# Altium project PMT_simulator.PrjPCB (part 2 of 3)

## Sheet LVDS_IFC.SchDoc: =TopTitle
size 420 x 297 mm; EDA_Number: ARTIQ; Projet: Zotino; CheckedBy: -; Author: G.Kasprowicz; CompanyName: WUT ISE; DrawnBy: G.Kasprowicz; Organization: WUT ISE; Address1: PW ISE; Address2: Nowowiejska 15/19 00-665 Warsaw; Address3: gkasprow@gmail.com; Revision: 1.0.1; SheetNumber: -; SheetTotal: -; ModifiedBy: -; CheckedDate: -; Title2: LVDS_IFC; DivGrp: WUT ISE; Designer: G.Kasprowicz; ModifiedDate: -; ProjectName: Sensor Box
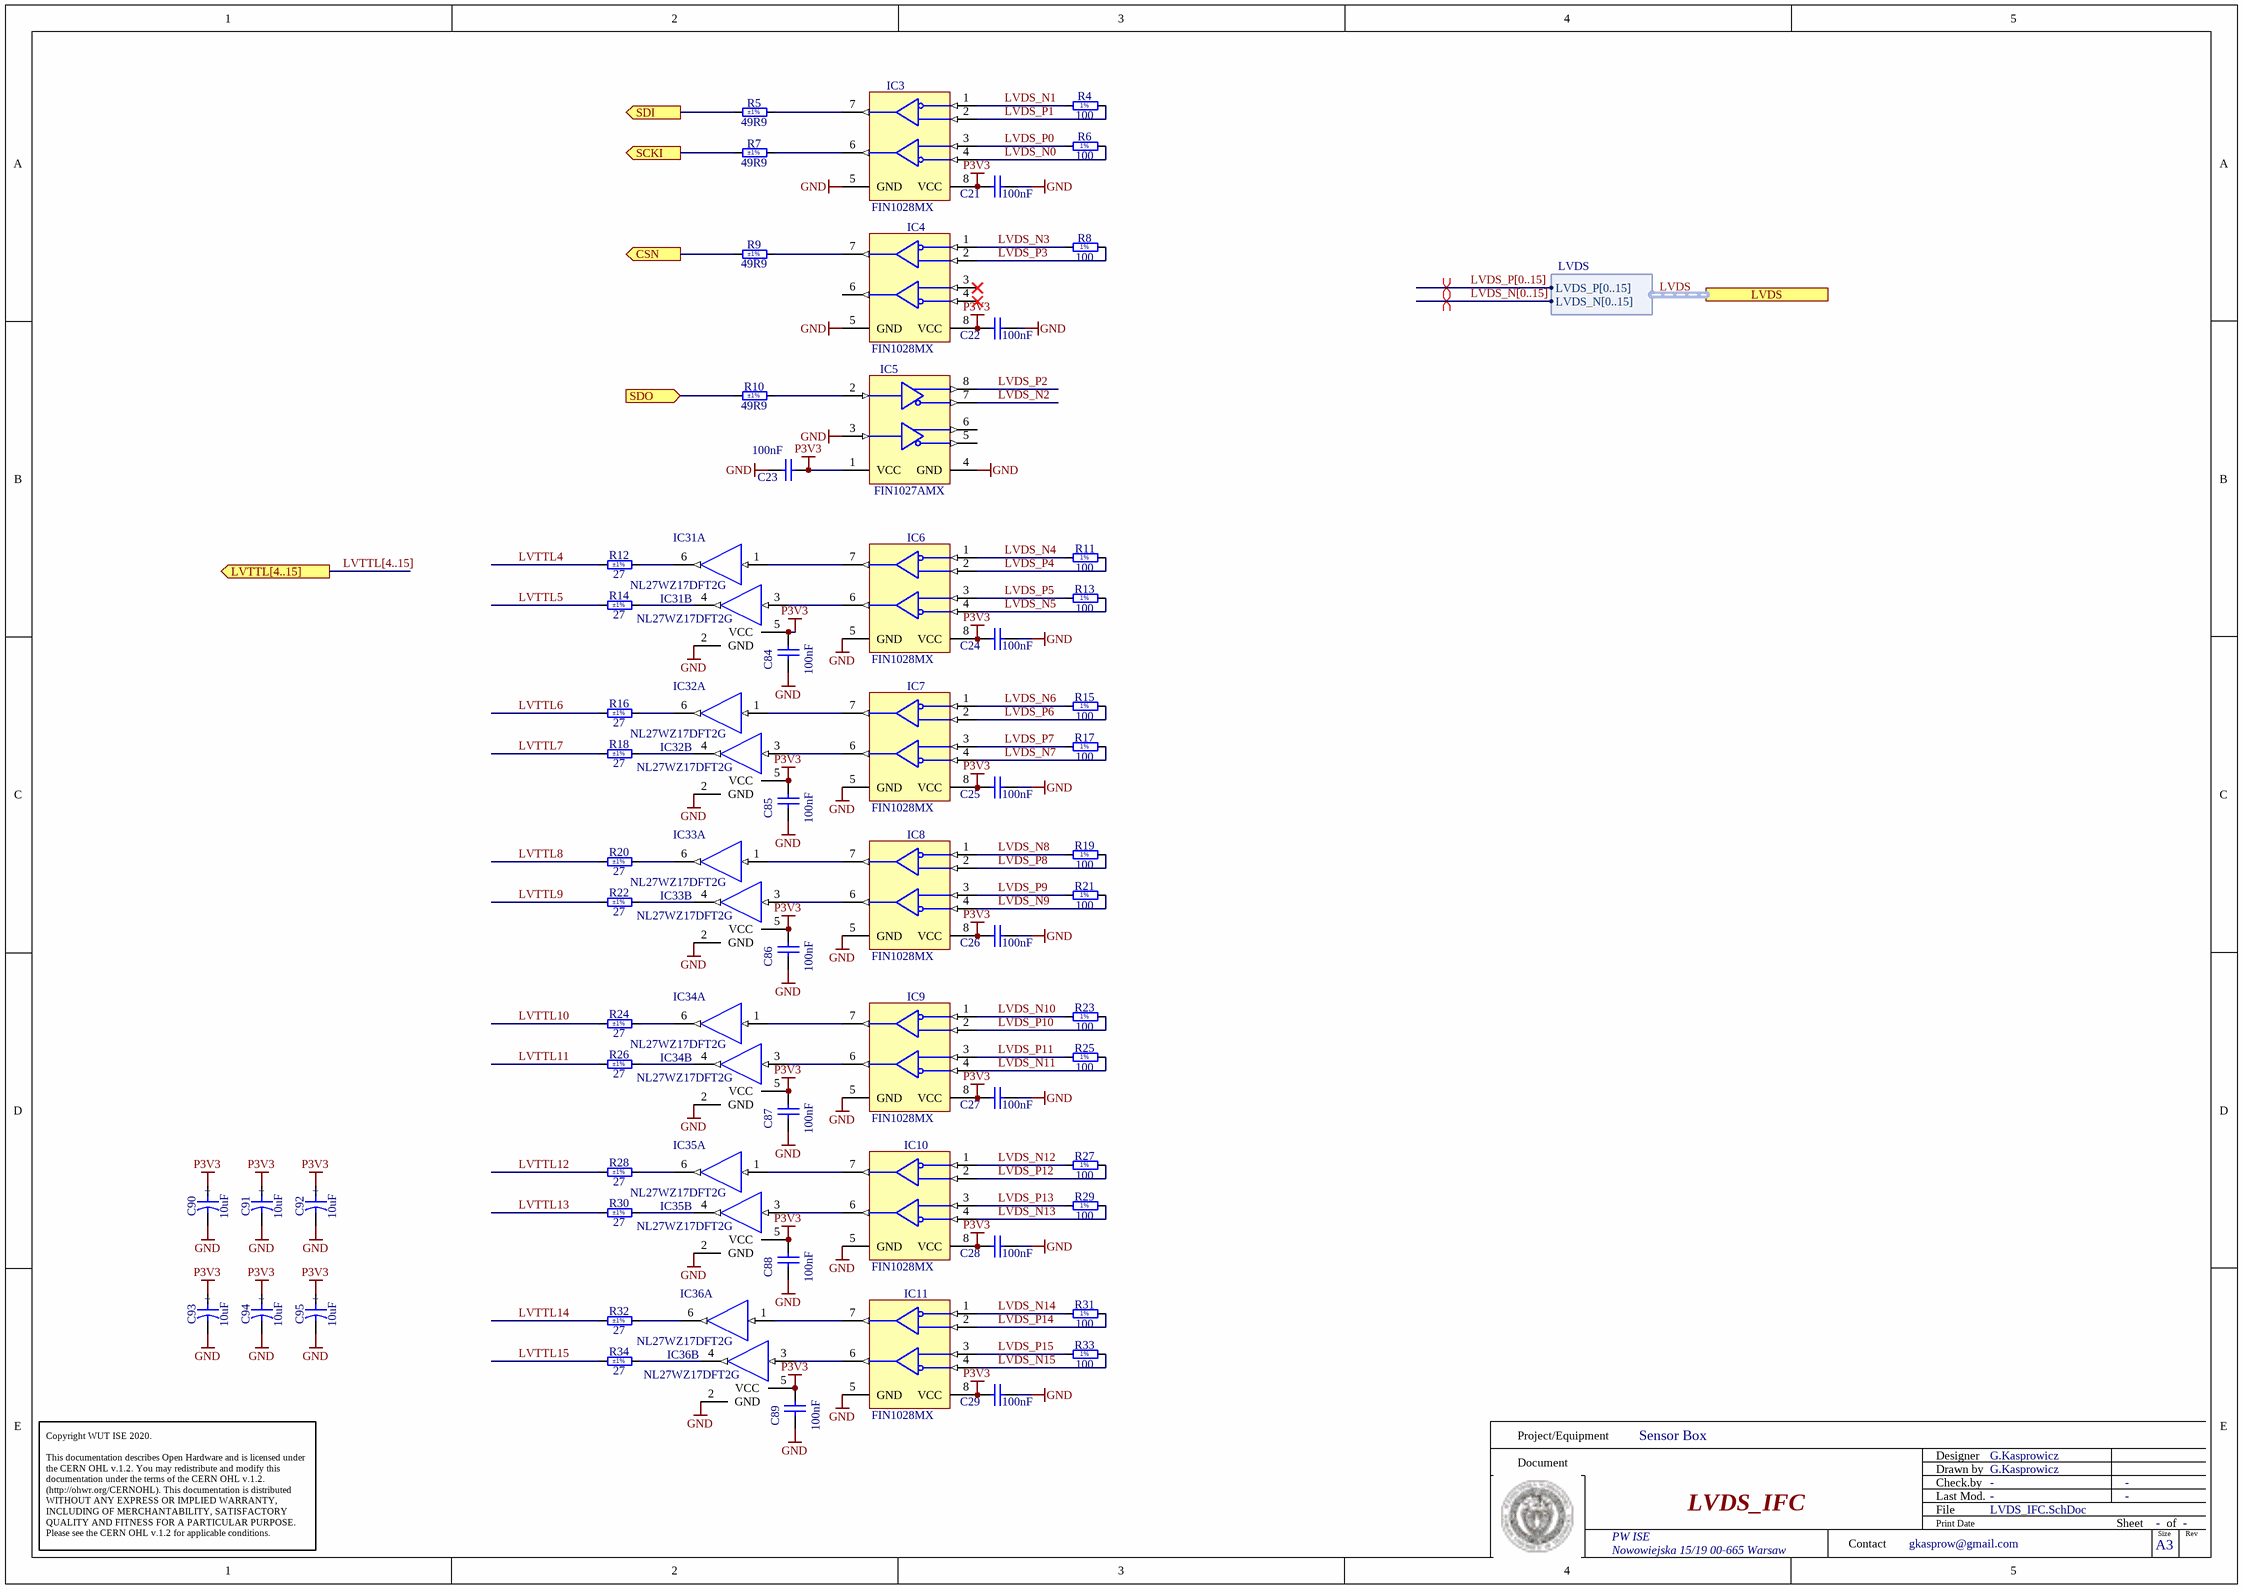
[diagram p3: LVDS_IFC.SchDoc]

### Parts
C21  100nF  [CAPC1005X55N]
C22  100nF  [CAPC1005X55N]
C23  100nF  [CAPC1005X55N]
C24  100nF  [CAPC1005X55N]
C25  100nF  [CAPC1005X55N]
C26  100nF  [CAPC1005X55N]
C27  100nF  [CAPC1005X55N]
C28  100nF  [CAPC1005X55N]
C29  100nF  [CAPC1005X55N]
C84  100nF  [CAPC1005X55N]
C85  100nF  [CAPC1005X55N]
C86  100nF  [CAPC1005X55N]
C87  100nF  [CAPC1005X55N]
C88  100nF  [CAPC1005X55N]
C89  100nF  [CAPC1005X55N]
C90  10uF  [CAPMP3216X180N]
C91  10uF  [CAPMP3216X180N]
C92  10uF  [CAPMP3216X180N]
C93  10uF  [CAPMP3216X180N]
C94  10uF  [CAPMP3216X180N]
C95  10uF  [CAPMP3216X180N]
IC3  FIN1028MX  [SOIC127P600X175-8N]
IC4  FIN1028MX  [SOIC127P600X175-8N]
IC5  FIN1027AMX  [SOIC127P600X175-8N]
IC6  FIN1028MX  [SOIC127P600X175-8N]
IC7  FIN1028MX  [SOIC127P600X175-8N]
IC8  FIN1028MX  [SOIC127P600X175-8N]
IC9  FIN1028MX  [SOIC127P600X175-8N]
IC10  FIN1028MX  [SOIC127P600X175-8N]
IC11  FIN1028MX  [SOIC127P600X175-8N]
IC31  NL27WZ17DFT2G  [SOT65P210X110-6N]  (parts A,B of 2)
IC32  NL27WZ17DFT2G  [SOT65P210X110-6N]  (parts A,B of 2)
IC33  NL27WZ17DFT2G  [SOT65P210X110-6N]  (parts A,B of 2)
IC34  NL27WZ17DFT2G  [SOT65P210X110-6N]  (parts A,B of 2)
IC35  NL27WZ17DFT2G  [SOT65P210X110-6N]  (parts A,B of 2)
IC36  NL27WZ17DFT2G  [SOT65P210X110-6N]  (parts A,B of 2)
R4  100  [RESC1005X40N]
R5  49R9  Tolerance: ±1%  [RESC1005X40N]
R6  100  [RESC1005X40N]
R7  49R9  Tolerance: ±1%  [RESC1005X40N]
R8  100  [RESC1005X40N]
R9  49R9  Tolerance: ±1%  [RESC1005X40N]
R10  49R9  Tolerance: ±1%  [RESC1005X40N]
R11  100  [RESC1005X40N]
R12  27  Tolerance: ±1%  [RESC1005X40N]
R13  100  [RESC1005X40N]
R14  27  Tolerance: ±1%  [RESC1005X40N]
R15  100  [RESC1005X40N]
R16  27  Tolerance: ±1%  [RESC1005X40N]
R17  100  [RESC1005X40N]
R18  27  Tolerance: ±1%  [RESC1005X40N]
R19  100  [RESC1005X40N]
R20  27  Tolerance: ±1%  [RESC1005X40N]
R21  100  [RESC1005X40N]
R22  27  Tolerance: ±1%  [RESC1005X40N]
R23  100  [RESC1005X40N]
R24  27  Tolerance: ±1%  [RESC1005X40N]
R25  100  [RESC1005X40N]
R26  27  Tolerance: ±1%  [RESC1005X40N]
R27  100  [RESC1005X40N]
R28  27  Tolerance: ±1%  [RESC1005X40N]
R29  100  [RESC1005X40N]
R30  27  Tolerance: ±1%  [RESC1005X40N]
R31  100  [RESC1005X40N]
R32  27  Tolerance: ±1%  [RESC1005X40N]
R33  100  [RESC1005X40N]
R34  27  Tolerance: ±1%  [RESC1005X40N]

### Ports
CSN (out), LVDS (harness LVDS), LVTTL[4..15] (out), SCKI (out), SDI (out), SDO (in)

### Harnesses
LVDS: LVDS_P[0..15], LVDS_N[0..15]

### Nets
GND: C21.1 C22.1 C23.1 C24.1 C25.1 C26.1 C27.1 C28.1 C29.1 C84.1 C85.1 C86.1 C87.1 C88.1 C89.1 C90.2 C91.2 C92.2 C93.2 C94.2 C95.2 IC3.5(GND) IC4.5(GND) IC5.3(DIN2RIN-) IC5.4(GND) IC6.5(GND) IC7.5(GND) IC8.5(GND) IC9.5(GND) IC10.5(GND) IC11.5(GND) IC31.2(GND) IC32.2(GND) IC33.2(GND) IC34.2(GND) IC35.2(GND) IC36.2(GND)
P3V3: C21.2 C22.2 C23.2 C24.2 C25.2 C26.2 C27.2 C28.2 C29.2 C84.2 C85.2 C86.2 C87.2 C88.2 C89.2 C90.1 C91.1 C92.1 C93.1 C94.1 C95.1 IC3.8(VCC) IC4.8(VCC) IC5.1(VCC) IC6.8(VCC) IC7.8(VCC) IC8.8(VCC) IC9.8(VCC) IC10.8(VCC) IC11.8(VCC) IC31.5(VCC) IC32.5(VCC) IC33.5(VCC) IC34.5(VCC) IC35.5(VCC) IC36.5(VCC)
VDD: IC31.5(VCC) IC32.5(VCC) IC33.5(VCC) IC34.5(VCC) IC35.5(VCC) IC36.5(VCC)
CSn: R9.1 ; port CSN
LVDS_N0: IC3.4(RIN2-) R6.2
LVDS_N1: IC3.1(RIN1-) R4.1
LVDS_N2: IC5.7(DOUT-)
LVDS_N3: IC4.1(RIN1-) R8.1
LVDS_N4: IC6.1(RIN1-) R11.1
LVDS_N5: IC6.4(RIN2-) R13.2
LVDS_N6: IC7.1(RIN1-) R15.1
LVDS_N7: IC7.4(RIN2-) R17.2
LVDS_N8: IC8.1(RIN1-) R19.1
LVDS_N9: IC8.4(RIN2-) R21.2
LVDS_N10: IC9.1(RIN1-) R23.1
LVDS_N11: IC9.4(RIN2-) R25.2
LVDS_N12: IC10.1(RIN1-) R27.1
LVDS_N13: IC10.4(RIN2-) R29.2
LVDS_N14: IC11.1(RIN1-) R31.1
LVDS_N15: IC11.4(RIN2-) R33.2
LVDS_P0: IC3.3(RIN2+) R6.1
LVDS_P1: IC3.2(RIN1+) R4.2
LVDS_P2: IC5.8(DOUT+)
LVDS_P3: IC4.2(RIN1+) R8.2
LVDS_P4: IC6.2(RIN1+) R11.2
LVDS_P5: IC6.3(RIN2+) R13.1
LVDS_P6: IC7.2(RIN1+) R15.2
LVDS_P7: IC7.3(RIN2+) R17.1
LVDS_P8: IC8.2(RIN1+) R19.2
LVDS_P9: IC8.3(RIN2+) R21.1
LVDS_P10: IC9.2(RIN1+) R23.2
LVDS_P11: IC9.3(RIN2+) R25.1
LVDS_P12: IC10.2(RIN1+) R27.2
LVDS_P13: IC10.3(RIN2+) R29.1
LVDS_P14: IC11.2(RIN1+) R31.2
LVDS_P15: IC11.3(RIN2+) R33.1
LVTTL4: R12.1
LVTTL5: R14.1
LVTTL6: R16.1
LVTTL7: R18.1
LVTTL8: R20.1
LVTTL9: R22.1
LVTTL10: R24.1
LVTTL11: R26.1
LVTTL12: R28.1
LVTTL13: R30.1
LVTTL14: R32.1
LVTTL15: R34.1
SCKI: R7.1 ; port SCKI
SDI: R5.1 ; port SDI
SDO: R10.1 ; port SDO
NetIC3_6: IC3.6(ROUT2) R7.2
NetIC3_7: IC3.7(ROUT1) R5.2
NetIC4_7: IC4.7(ROUT1) R9.2
NetIC5_2: IC5.2(DIN1) R10.2
NetIC6_6: IC6.6(ROUT2) IC31.3(IN)
NetIC6_7: IC6.7(ROUT1) IC31.1(IN)
NetIC7_6: IC7.6(ROUT2) IC32.3(IN)
NetIC7_7: IC7.7(ROUT1) IC32.1(IN)
NetIC8_6: IC8.6(ROUT2) IC33.3(IN)
NetIC8_7: IC8.7(ROUT1) IC33.1(IN)
NetIC9_6: IC9.6(ROUT2) IC34.3(IN)
NetIC9_7: IC9.7(ROUT1) IC34.1(IN)
NetIC10_6: IC10.6(ROUT2) IC35.3(IN)
NetIC10_7: IC10.7(ROUT1) IC35.1(IN)
NetIC11_6: IC11.6(ROUT2) IC36.3(IN)
NetIC11_7: IC11.7(ROUT1) IC36.1(IN)
NetIC31_4: IC31.4(OUT) R14.2
NetIC31_6: IC31.6(OUT) R12.2
NetIC32_4: IC32.4(OUT) R18.2
NetIC32_6: IC32.6(OUT) R16.2
NetIC33_4: IC33.4(OUT) R22.2
NetIC33_6: IC33.6(OUT) R20.2
NetIC34_4: IC34.4(OUT) R26.2
NetIC34_6: IC34.6(OUT) R24.2
NetIC35_4: IC35.4(OUT) R30.2
NetIC35_6: IC35.6(OUT) R28.2
NetIC36_4: IC36.4(OUT) R34.2
NetIC36_6: IC36.6(OUT) R32.2

Not connected (* = marked no-connect by the designer): IC4 3(RIN2+)* 4(RIN2-)* 6(ROUT2); IC5 5(DOUT-) 6(DOUT+)

### Buses and harness runs
bus LVDS_N[0..15]
bus LVDS_P[0..15]
bus LVTTL[4..15] = port LVTTL[4..15]
harness LVDS = port LVDS

### Layout directives
differential pair: (no net found under the mark)

### Notes on the sheet
- Project/Equipment
- Document
- Designer
- Drawn by
- Check.by
- Copyright WUT ISE 2020.
  This documentation describes Open Hardware and is licensed under the CERN OHL v.1.2. You may redistribute and modify this documentation under the terms of the CERN OHL v.1.2. (http://ohwr.org/CERNOHL). This documentation is distributed WITHOUT ANY EXPRESS OR IMPLIED WARRANTY, INCLUDING OF MERCHANTABILITY, SATISFACTORY QUALITY AND FITNESS FOR A PARTICULAR PURPOSE. Please see the CERN OHL v.1.2 for applicable conditions.
- Contact
- File
- Last Mod.
- Print Date
- Sheet
- Size
- A3
- of
- Rev
- (in symbol CTE3216-18_10UF_16V_20%_AVX_TCJ) +
- (in symbol R0402_100R_1%_0.0625W_100PPM) 1%

### Library data of the parts
C21-C29 C84-C89 = CC0402_100NF_16V_10%_X5R: Non-polarised capacitor; Part Description: SMD Multilayer Chip Ceramic Capacitor; Manufacturer: GENERIC; Manufacturer1 Part Number: GRM155R61C104KA88D; Voltage: 16V; TC: X5R; Tolerance: ±10%; Part Number: CC0402_100NF_16V_10%_X5R; Component Kind: Standard; Component Type: Standard; Pin Count: 2; Value: 100nF; Status: None; Manufacturer Part Number: CC0402_100NF_16V_10%_X5R; Case: 0402; Mounted: Yes; Socket: No; SMD: Yes; Sense: No; Manufacturer1 Example: MURATA; Manufacturer1 ComponentHeight: 0.55mm; HelpURL: \\cern.ch\dfs\Applications\Altium\Datasheets\CC0402_X5R_MURATA_GRM.pdf; Author: CERN DEM JLC; CreateDate: 10.12.2013; LatestRevisionDate: 10.12.2013
C90-C95 = CTE3216-18_10UF_16V_20%_AVX_TCJ: Polarised capacitor; Part Description: ESR 0R200 Tantalum Solid Electrolytic Chip Capacitor with Conductive Polymer Electrode; Manufacturer: AVX; Manufacturer Part Number: TCJA106M016R0200; Voltage: 16V; Tolerance: ±20%; Part Number: CTE3216-18_10UF_16V_20%_AVX_TCJ; Component Kind: Standard; Component Type: Standard; Pin Count: 2; Value: 10uF; Status: Preferred; Case: A; Mounted: Yes; Socket: No; SMD: Yes; Sense: No; ComponentHeight: 1.8mm; HelpURL: \\cern.ch\dfs\Applications\Altium\Datasheets\CTE_AVX_TCJ.pdf; Author: CERN DEM JLC; CreateDate: 29.03.2012; LatestRevisionDate: 29.03.2012
IC3 IC4 IC6-IC11 = IFC_FIN1028: 3.3V LVDS 2-Bit High-Speed Differential Reciever; Manufacturer: ON Semiconductor; PressFit: No; Bonding: No; Part Number: FIN1028MX; Component Kind: Standard; Component Type: Standard; Device: FIN1028MX; PackageDescription: SOIC 8, Pitch 1.27mm - Body 4x5mm, IPC Medium Density; Part Description: 3.3V LVDS 2-Bit High-Speed Differential Reciever; Manufacturer Part Number: FIN1028MX; Pin Count: 8; Case: SOIC8; Mounted: Yes; Socket: No; SMD: Yes; Sense: No; ComponentHeight: 0.8mm; Author: GK; HelpURL: \\cern.ch\dfs\Applications\Altium\Datasheets\FIN1101K8X.pdf; CreateDate: 08/11/2016; LatestRevisionDate: 08/11/2016
IC5 = IFC_FIN1027A: 3.3V LVDS, 2-Bit, High-Speed, Differential Driver; Manufacturer: ON Semiconductor; PressFit: No; Bonding: No; Part Number: FIN1027AMX; Component Kind: Standard; Component Type: Standard; Device: FIN1027AMX; PackageDescription: SOIC 8, Pitch 1.27mm - Body 4x5mm, IPC Medium Density; Part Description: 3.3V LVDS, 2-Bit, High-Speed, Differential Driver; Manufacturer Part Number: FIN1027AMX; Pin Count: 8; Case: SOIC8; Mounted: Yes; Socket: No; SMD: Yes; Sense: No; ComponentHeight: 0.8mm; Author: GK; HelpURL: \\cern.ch\dfs\Applications\Altium\Datasheets\FIN1101K8X.pdf; CreateDate: 08/11/2016; LatestRevisionDate: 08/11/2016
IC31-IC36 = NL27WZ17DFT2G: Dual Schmitt Trigger Buffer, Non-Inverting; Manufacturer: ON SEMICONDUCTOR; PressFit: No; Bonding: No; Part Number: NL27WZ17DFT2G; Component Kind: Standard; Component Type: Standard; Device: NL27WZ17DFT2G; PackageDescription: SOT363, SC-88, 0.65mm Pitch; 6 Pin, 1.25mm W X 2.00mm L X 1.10mm H body, IPC Medium Density; Part Description: Dual Schmitt Trigger Buffer, Non-Inverting; Manufacturer Part Number: NL27WZ17DF; Pin Count: 6; Case: SOT363; Mounted: Yes; Socket: No; SMD: Yes; Sense: No; ComponentHeight: 1.1mm; Author: CERN DEM BC; HelpURL: \\cern.ch\dfs\Applications\Altium\Datasheets\NL27WZ17DFT2G.pdf; CreateDate: 02.06.2020; LatestRevisionDate: 25.05.2022
R4 R6 R8 R11 R13 R15 R17 R19 R21 R23 R25 R27 R29 R31 R33 = R0402_100R_1%_0.0625W_100PPM: Resistor - 1%; Part Description: General Purpose Thick Film Chip Resistor; Manufacturer: GENERIC; Manufacturer1 Part Number: 232270671001L; TC: ±100ppm/°C; PressFit: No; Part Number: R0402_100R_1%_0.0625W_100PPM; Component Kind: Standard; Component Type: Standard; Pin Count: 2; Value: 100; Status: Not Recommended; Power: 0.0625W; Tolerance: ±1%; Manufacturer Part Number: R0402_100R_1%_0.0625W_100PPM; Case: 0402; Mounted: Yes; Sense: No; Socket: No; SMD: Yes; Manufacturer1 Example: YAGEO PHYCOMP; Manufacturer1 ComponentHeight: 0.4mm; HelpURL: \\cern.ch\dfs\Applications\Altium\Datasheets\R0402_Phycomp_RC0402.pdf; Author: CERN DEM JLC; CreateDate: 03.12.2007; LatestRevisionDate: 17.10.2012
R5 R7 R9 R10 = R0402_49R9_1%_0.0625W_100PPM: Resistor - 1%; Part Description: General Purpose Thick Film Chip Resistor; Manufacturer: GENERIC; Manufacturer1 Part Number: 232270674999L or RC0402FR-0749R9L; TC: ±100ppm/°C; PressFit: No; Part Number: R0402_49R9_1%_0.0625W_100PPM; Component Kind: Standard; Component Type: Standard; Pin Count: 2; Value: 49R9; Status: Not Recommended; Power: 0.0625W; Manufacturer Part Number: R0402_49R9_1%_0.0625W_100PPM; Case: 0402; Mounted: Yes; Sense: No; Socket: No; SMD: Yes; Manufacturer1 Example: YAGEO PHYCOMP; Manufacturer1 ComponentHeight: 0.4mm; HelpURL: \\cern.ch\dfs\Applications\Altium\Datasheets\R0402_Phycomp_RC0402.pdf; Author: CERN DEM JLC; CreateDate: 24.10.2012; LatestRevisionDate: 24.10.2012
R12 R14 R16 R18 R20 R22 R24 R26 R28 R30 R32 R34 = R0402_27R_1%_0.0625W_100PPM: Resistor - 1%; Part Description: General Purpose Thick Film Chip Resistor; Manufacturer: GENERIC; Manufacturer1 Part Number: 232270672709L; TC: ±100ppm/°C; PressFit: No; Part Number: R0402_27R_1%_0.0625W_100PPM; Component Kind: Standard; Component Type: Standard; Pin Count: 2; Value: 27; Status: Not Recommended; Power: 0.0625W; Manufacturer Part Number: R0402_27R_1%_0.0625W_100PPM; Case: 0402; Mounted: Yes; Sense: No; Socket: No; SMD: Yes; Manufacturer1 Example: YAGEO PHYCOMP; Manufacturer1 ComponentHeight: 0.4mm; HelpURL: \\cern.ch\dfs\Applications\Altium\Datasheets\R0402_Phycomp_RC0402.pdf; Author: CERN DEM JLC; CreateDate: 03.12.2007; LatestRevisionDate: 17.10.2012

## Sheet PULSE_TRIGGER.SchDoc: =TopTitle
size 420 x 297 mm; EDA_Number: ARTIQ; Projet: ALICE; CheckedBy: -; Author: G.Kasprowicz; CompanyName: WUT ISE; DrawnBy: G.Kasprowicz; Organization: WUT ISE; Address1: PW ISE; Address2: Nowowiejska 15/19 00-665 Warsaw; Address3: gkasprow@gmail.com; Revision: 1.0.1; SheetNumber: -; SheetTotal: -; ModifiedBy: -; CheckedDate: -; Title2: Pulse Trigger; DivGrp: WUT ISE; Designer: G.Kasprowicz; ModifiedDate: -; ProjectName: Sensor Box
Used 6 times, as channels U_PULSE_TRIGGER, U_PULSE_TRIGGER, U_PULSE_TRIGGER, U_PULSE_TRIGGER, U_PULSE_TRIGGER, U_PULSE_TRIGGER. Parts and nets are listed once, with the designators drawn on the sheet.
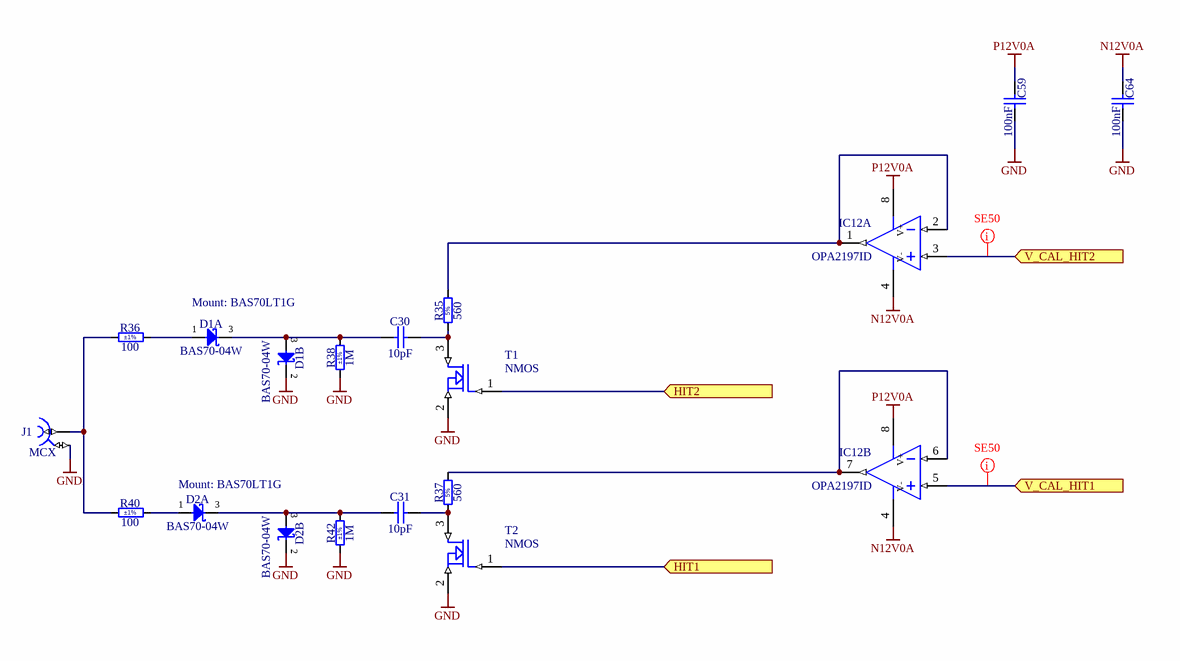
[diagram p4: PULSE_TRIGGER.SchDoc]

### Parts
C30  10pF  [CAPC1608X87N]
C31  10pF  [CAPC1608X87N]
C59  100nF  [CAPC1005X55N]
C64  100nF  [CAPC1005X55N]
D1  BAS70-04W  [SOT65P210X110-3N]  (parts A,B of 2)
D2  BAS70-04W  [SOT65P210X110-3N]  (parts A,B of 2)
IC12  OPA2197ID  [SOIC127P600X175-8N]  (parts A,B of 2)
J1  MCX  [AMPHENOL_919-383J-51A]
R35  560  [RESC2012X70N]
R36  100  Tolerance: ±1%  [RESC1608X55N]
R37  560  [RESC2012X70N]
R38  1M  Tolerance: ±1%  [RESC1608X55N]
R40  100  Tolerance: ±1%  [RESC1608X55N]
R42  1M  Tolerance: ±1%  [RESC1608X55N]
T1  NMOS  [CSD15380F3]
T2  NMOS  [CSD15380F3]

### Ports
HIT1 (in), HIT2 (in), V_CAL_HIT1 (in), V_CAL_HIT2 (in)

### Nets
GND: C59.1 C64.1 D1.2(C) D2.2(C) J1.2 R38.1 R42.1 T1.2(S) T2.2(S)
N12V0A: C64.2 IC12.4(V-)
P12V0A: C59.2 IC12.8(V+)
HIT1: T2.1(G) ; port HIT1
HIT2: T1.1(G) ; port HIT2
V_CAL_HIT1: IC12.5(IN+) ; port V_CAL_HIT1
V_CAL_HIT2: IC12.3(IN+) ; port V_CAL_HIT2
NetC30_1: C30.1 D1.3(COMAC) R38.2
NetC30_2: C30.2 R35.1 T1.3(D)
NetC31_1: C31.1 D2.3(COMAC) R42.2
NetC31_2: C31.2 R37.1 T2.3(D)
NetD1_1: D1.1(A) R36.2
NetD2_1: D2.1(A) R40.2
NetIC12_1: IC12.1(OUT) IC12.2(IN-) R35.2
NetIC12_6: IC12.6(IN-) IC12.7(OUT) R37.2
NetJ1_1: J1.1 R36.1 R40.1

### Channels
U_PULSE_TRIGGER: designators end in A; ports HIT1=LVTTL4 HIT2=LVTTL5 V_CAL_HIT1=VOUT1 V_CAL_HIT2=VOUT2
U_PULSE_TRIGGER: designators end in B; ports HIT1=LVTTL6 HIT2=LVTTL7 V_CAL_HIT1=VOUT3 V_CAL_HIT2=VOUT4
U_PULSE_TRIGGER: designators end in C; ports HIT1=LVTTL8 HIT2=LVTTL9 V_CAL_HIT1=VOUT5 V_CAL_HIT2=VOUT6
U_PULSE_TRIGGER: designators end in D; ports HIT1=LVTTL10 HIT2=LVTTL11 V_CAL_HIT1=VOUT7 V_CAL_HIT2=VOUT8
U_PULSE_TRIGGER: designators end in E; ports HIT1=LVTTL12 HIT2=LVTTL13 V_CAL_HIT1=VOUT9 V_CAL_HIT2=VOUT10
U_PULSE_TRIGGER: designators end in F; ports HIT1=LVTTL14 HIT2=LVTTL15 V_CAL_HIT1=VOUT11 V_CAL_HIT2=VOUT12

### Layout directives
net class SE50: VOUT1, VOUT2

### Notes on the sheet
- (near D1) Mount: BAS70LT1G
- (near D2) Mount: BAS70LT1G
- Project/Equipment
- Document
- Designer
- Drawn by
- Check.by
- Copyright WUT ISE 2020.
  This documentation describes Open Hardware and is licensed under the CERN OHL v.1.2. You may redistribute and modify this documentation under the terms of the CERN OHL v.1.2. (http://ohwr.org/CERNOHL). This documentation is distributed WITHOUT ANY EXPRESS OR IMPLIED WARRANTY, INCLUDING OF MERCHANTABILITY, SATISFACTORY QUALITY AND FITNESS FOR A PARTICULAR PURPOSE. Please see the CERN OHL v.1.2 for applicable conditions.
- Contact
- File
- Last Mod.
- Print Date
- Sheet
- Size
- A3
- of
- Rev
- (in symbol R0805_560R_5%_0.25W_200PPM_PANASONIC_ERJT) 5%

### Library data of the parts
C30 C31 = CC0603_10PF_50V_5%_NP0: Non-polarised capacitor; Part Description: SMD Multilayer Chip Ceramic Capacitor; Manufacturer: GENERIC; Manufacturer1 Part Number: 223886715109; Voltage: 50V; TC: C0G/NP0; Tolerance: ±5%; Part Number: CC0603_10PF_50V_5%_NP0; Component Kind: Standard; Component Type: Standard; Pin Count: 2; Value: 10pF; Status: Preferred; Manufacturer Part Number: CC0603_10PF_50V_5%_NP0; Case: 0603; Mounted: Yes; Socket: No; SMD: Yes; Sense: No; Manufacturer1 Example: PHYCOMP; Manufacturer1 ComponentHeight: 0.87mm; HelpURL: \\cern.ch\dfs\Applications\Altium\Datasheets\CC0603_NP0_PHYCOMP.pdf; Author: CERN DEM JLC; CreateDate: 03.12.2007; LatestRevisionDate: 03.12.2007
C59 C64 = CC0402_100NF_16V_10%_X7R: Non-polarised capacitor; Part Description: SMD Multilayer Chip Ceramic Capacitor; Manufacturer: GENERIC; Manufacturer1 Part Number: GRM155R71C104KA88D; Voltage: 16V; TC: X7R; Tolerance: ±10%; Part Number: CC0402_100NF_16V_10%_X7R; Component Kind: Standard; Component Type: Standard; Pin Count: 2; Value: 100nF; Status: Not Recommended; Manufacturer Part Number: CC0402_100NF_16V_10%_X7R; Case: 0402; Mounted: Yes; Socket: No; SMD: Yes; Sense: No; Manufacturer1 Example: MURATA; Manufacturer1 ComponentHeight: 0.55mm; HelpURL: \\cern.ch\dfs\Applications\Altium\Datasheets\CC0402_X7R_MURATA_GRM.pdf; Author: CERN DEM JLC; CreateDate: 05.12.2013; LatestRevisionDate: 03.12.2007
D1 D2 = BAS70-04W: Serial Schottky Diode; Part Description: Dual Series General-Purpose Schottky Diodes; Manufacturer: NXP SEMICONDUCTORS; Voltage: 70V; Power: 70mA; PressFit: No; Bonding: No; Part Number: BAS70-04W; Component Kind: Standard; Component Type: Standard; Device: BAS70-04W; PackageDescription: SOT323, 0.65mm Pitch; 3 Pin, 1.25mm W X 2.00mm L X 1.10mm H body, IPC Medium Density; Manufacturer Part Number: BAS70-04W; Pin Count: 3; Case: SOT323; Mounted: Yes; Socket: No; SMD: Yes; Sense: No; ComponentHeight: 1.10mm; HelpURL: \\cern.ch\dfs\Applications\Altium\Datasheets\BAS70-04W.pdf; Author: CERN DEM JLC; CreateDate: 05.12.2013; LatestRevisionDate: 05.12.2013
IC12 = OPA2197ID: Dual Operational Amplifier; Part Description: Dual, 36-V, Precision, Rail-to-Rail Input/Output, Low Offset Voltage, Operational Amplifiers; Manufacturer: TEXAS INSTRUMENTS; PressFit: No; Bonding: No; Part Number: OPA2197ID; Component Kind: Standard; Component Type: Standard; Device: OPA2197ID; PackageDescription: SOIC 8, Pitch 1.27mm - Body 4x5mm, IPC Medium Density; Manufacturer Part Number: OPA2197ID; Pin Count: 8; Case: SOIC8; Mounted: Yes; Socket: No; SMD: Yes; Sense: No; ComponentHeight: 1.75mm; Author: CERN DEM MR; HelpURL: \\cern.ch\dfs\Applications\Altium\Datasheets\OPA2197ID.pdf; CreateDate: 07.08.2019; LatestRevisionDate: 07.08.2019
J1 = AMPHENOL_919-383J-51A: Part Description: 50 Ohms, RF Connector, MCX Right Angle PCB Receptacle Jack; PressFit: No; Part Number: AMPHENOL_919-383J-51A; Component Kind: Standard; Component Type: Standard; Pin Count: 5; Family: MCX; Mounted: Yes; Socket: No; SMD: No; Sense: No; Status: None; Manufacturer: AMPHENOL; Manufacturer Part Number: 919-383J-51A; ComponentHeight: 6mm; HelpURL: \\cern.ch\dfs\Applications\Altium\Datasheets\AMPHENOL_919-383J-51A.pdf; Author: CERN DEM BC; CreateDate: 31.01.2019; LatestRevisionDate: 31.01.2019
R35 R37 = R0805_560R_5%_0.25W_200PPM_PANASONIC_ERJT: Resistor - 5%; Part Description: 200V, Anti-Pulse Thick Film Chip Resistor; Manufacturer Part Number: ERJT06J561V; Power: 0.25W; TC: ±200ppm/°C; Voltage: 200V; PressFit: No; Part Number: R0805_560R_5%_0.25W_200PPM_PANASONIC_ERJT; Component Kind: Standard; Component Type: Standard; Pin Count: 2; Value: 560; Status: None; Tolerance: ±5%; Manufacturer: PANASONIC; Case: 0805; Mounted: Yes; Sense: No; Socket: No; SMD: Yes; ComponentHeight: 0.7mm; HelpURL: \\cern.ch\dfs\Applications\Altium\Datasheets\R0805_PANASONIC_ERJT06.pdf; Author: CERN DEM MR; CreateDate: 08.01.2018; LatestRevisionDate: 08.01.2018
R36 R40 = R0603_100R_1%_0.1W_100PPM: Resistor - 1%; Part Description: General Purpose Thick Film Chip Resistor; Manufacturer: GENERIC; Manufacturer1 Part Number: NRC06F4700TRF; Power: 0.1W; TC: ±100ppm/°C; PressFit: No; Part Number: R0603_100R_1%_0.1W_100PPM; Component Kind: Standard; Component Type: Standard; Pin Count: 2; Value: 100; Status: Preferred; Manufacturer Part Number: R0603_100R_1%_0.1W_100PPM; Case: 0603; Mounted: Yes; Sense: No; Socket: No; SMD: Yes; Manufacturer1 Example: NIC COMPONENT; Manufacturer1 ComponentHeight: 0.55mm; HelpURL: \\cern.ch\dfs\Applications\Altium\Datasheets\R0603_NIC_NRC.pdf; Author: CERN DEM JLC; CreateDate: 03.12.2007; LatestRevisionDate: 13.03.2008
R38 R42 = R0603_1M_1%_0.1W_100PPM: Resistor - 1%; Part Description: General Purpose Thick Film Chip Resistor; Manufacturer: GENERIC; Manufacturer1 Part Number: NRC06F1004TRF; Power: 0.1W; TC: ±100ppm/°C; PressFit: No; Part Number: R0603_1M_1%_0.1W_100PPM; Component Kind: Standard; Component Type: Standard; Pin Count: 2; Value: 1M; Status: Preferred; Manufacturer Part Number: R0603_1M_1%_0.1W_100PPM; Case: 0603; Mounted: Yes; Sense: No; Socket: No; SMD: Yes; Manufacturer1 Example: NIC COMPONENT; Manufacturer1 ComponentHeight: 0.55mm; HelpURL: \\cern.ch\dfs\Applications\Altium\Datasheets\R0603_NIC_NRC.pdf; Author: CERN DEM JLC; CreateDate: 03.12.2007; LatestRevisionDate: 13.03.2008
T1 T2 = Q_MOSFET N: 20-V, N channel NexFET™ power MOSFET, single LGA 0.6 mm x 0.7 mm, 1460 mOhm, gate ESD protection; Manufacturer Part Number: CSD15380F3

## Sheet DAC.SchDoc: =TopTitle
size 420 x 297 mm; EDA_Number: ARTIQ; Projet: ALICE; CheckedBy: -; Author: G.Kasprowicz; CompanyName: WUT ISE; DrawnBy: G.Kasprowicz; Organization: WUT ISE; Address1: PW ISE; Address2: Nowowiejska 15/19 00-665 Warsaw; Address3: gkasprow@gmail.com; Revision: 1.0.1; SheetNumber: -; SheetTotal: -; ModifiedBy: -; CheckedDate: -; Title2: DAC; DivGrp: WUT ISE; Designer: G.Kasprowicz; ModifiedDate: -; ProjectName: Sensor Box
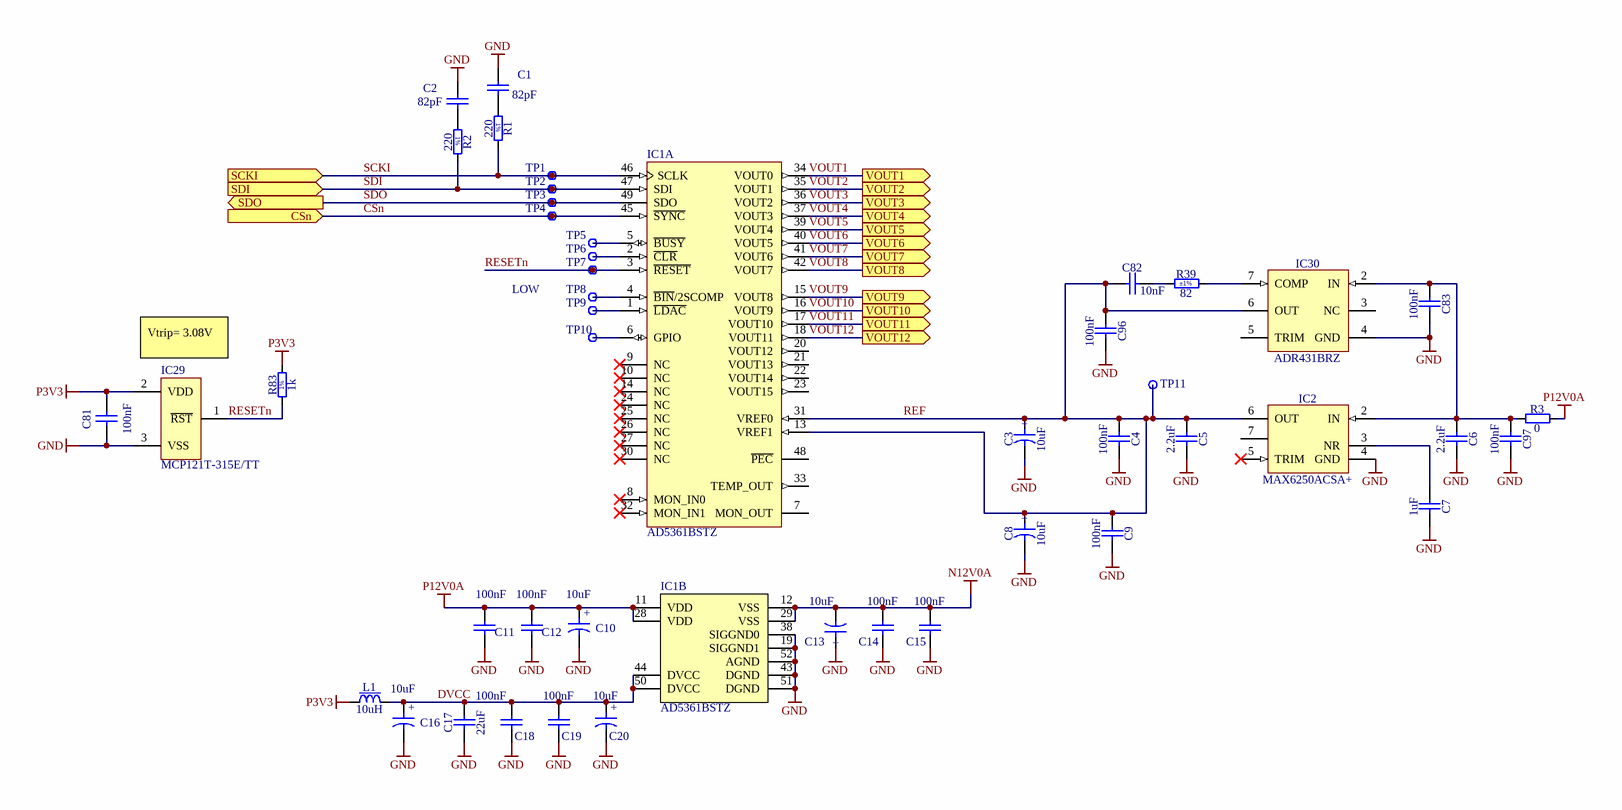
[diagram p5: DAC.SchDoc]

### Parts
C1  82pF  [CAPC1608X87N]
C2  82pF  [CAPC1608X87N]
C3  10uF  [CAPMP3216X180N]
C4  100nF  [CAPC1005X55N]
C5  2.2uF  [CAPC1608X87N]
C6  2.2uF  [CAPC1608X87N]
C7  1uF  [CAPC1608X87N]
C8  10uF  [CAPMP3216X180N]
C9  100nF  [CAPC1005X55N]
C10  10uF  [CAPMP3216X180N]
C11  100nF  [CAPC1005X55N]
C12  100nF  [CAPC1005X55N]
C13  10uF  [CAPMP3216X180N]
C14  100nF  [CAPC1005X55N]
C15  100nF  [CAPC1005X55N]
C16  10uF  [CAPMP3216X180N]
C17  22uF  [CAPC2012X135N]
C18  100nF  [CAPC1005X55N]
C19  100nF  [CAPC1005X55N]
C20  10uF  [CAPMP3216X180N]
C81  100nF  [CAPC1005X55N]
C82  10nF  [CAPC1005X55N]
C83  100nF  [CAPC1005X55N]
C96  100nF  [CAPC1005X55N]
C97  100nF  [CAPC1005X55N]
IC1  AD5361BSTZ  [ST-52_N]  (parts A,B of 2)
IC2  MAX6250ACSA+  [SOIC127P600X175-8N]
IC29  MCP121T-315E/TT  [SOT-23-TT3_L]
IC30  ADR431BRZ  [SOIC127P600X175-8N]
L1  10uH  [IND_MURATA-PS_8400]
R1  220  [RESC1608X55N]
R2  220  [RESC1608X55N]
R3  0  [RESC1005X40N]
R39  82  Tolerance: ±1%  [RESC1005X40N]
R83  1k  [RESC1005X40N]
TP1  Test Point  [TPS127]  (value not drawn)  (no BOM)
TP2  Test Point  [TPS127]  (value not drawn)  (no BOM)
TP3  Test Point  [TPS127]  (value not drawn)  (no BOM)
TP4  Test Point  [TPS127]  (value not drawn)  (no BOM)
TP5  Test Point  [TPS127]  (value not drawn)  (no BOM)
TP6  Test Point  [TPS127]  (value not drawn)  (no BOM)
TP7  Test Point  [TPS127]  (value not drawn)  (no BOM)
TP8  Test Point  [TPS127]  (value not drawn)  (no BOM)
TP9  Test Point  [TPS127]  (value not drawn)  (no BOM)
TP10  Test Point  [TPS127]  (value not drawn)  (no BOM)
TP11  Test Point  [TPS127]  (value not drawn)  (no BOM)

### Ports
CSn (in), SCKI (in), SDI (in), SDO (out), VOUT1 (out), VOUT2 (out), VOUT3 (out), VOUT4 (out), VOUT5 (out), VOUT6 (out), VOUT7 (out), VOUT8 (out), VOUT9 (out), VOUT10 (out), VOUT11 (out), VOUT12 (out)

### Nets
GND: C1.1 C2.1 C3.2 C4.1 C5.1 C6.1 C7.1 C8.2 C9.1 C10.2 C11.1 C12.1 C13.1 C14.1 C15.1 C16.2 C17.1 C18.1 C19.1 C20.2 C81.1 C83.1 C96.1 C97.1 IC1.19(SIGGND1) IC1.38(SIGGND0) IC1.43(DGND) IC1.51(DGND) IC1.52(AGND) IC2.4(GND) IC29.3(VSS) IC30.4(GND)
N12V0A: C13.2 C14.2 C15.2 IC1.12(VSS) IC1.29(VSS)
P3V3: C81.2 IC29.2(VDD) L1.1 R83.2
P12V0A: C10.1 C11.2 C12.2 IC1.11(VDD) IC1.28(VDD) R3.1
CSn: IC1.45(~{SYNC}) TP4.1 ; port CSn
DVCC: C16.1 C17.2 C18.2 C19.2 C20.1 IC1.44(DVCC) IC1.50(DVCC) L1.2
REF: C3.1 C4.2 C5.2 C8.1 C9.2 C82.1 C96.2 IC1.13(VREF1) IC1.31(VREF0) IC2.6(OUT) IC30.6(OUT) TP11.1
RESETn: IC1.3(~{RESET}) IC29.1(~{RST}) R83.1 TP7.1
SCKI: IC1.46(SCLK) R1.2 TP1.1 ; port SCKI
SDI: IC1.47(SDI) R2.2 TP2.1 ; port SDI
SDO: IC1.49(SDO) TP3.1 ; port SDO
VOUT1: IC1.34(VOUT0) ; port VOUT1
VOUT2: IC1.35(VOUT1) ; port VOUT2
VOUT3: IC1.36(VOUT2) ; port VOUT3
VOUT4: IC1.37(VOUT3) ; port VOUT4
VOUT5: IC1.39(VOUT4) ; port VOUT5
VOUT6: IC1.40(VOUT5) ; port VOUT6
VOUT7: IC1.41(VOUT6) ; port VOUT7
VOUT8: IC1.42(VOUT7) ; port VOUT8
VOUT9: IC1.15(VOUT8) ; port VOUT9
VOUT10: IC1.16(VOUT9) ; port VOUT10
VOUT11: IC1.17(VOUT10) ; port VOUT11
VOUT12: IC1.18(VOUT11) ; port VOUT12
NetC1_2: C1.2 R1.1
NetC2_2: C2.2 R2.1
NetC6_2: C6.2 C83.2 C97.2 IC2.2(IN) IC30.2(IN) R3.2
NetC7_2: C7.2 IC2.3(NR)
NetC82_2: C82.2 R39.1
NetIC1_1: IC1.1(~{LDAC}) TP9.1
NetIC1_2: IC1.2(~{CLR}) TP6.1
NetIC1_4: IC1.4(~{BIN}/2SCOMP) TP8.1
NetIC1_5: IC1.5(~{BUSY}) TP5.1
NetIC1_6: IC1.6(GPIO) TP10.1
NetIC30_7: IC30.7(COMP) R39.2

Not connected (* = marked no-connect by the designer): IC1 7(MON_OUT) 8(MON_IN0)* 9(NC)* 10(NC)* 14(NC)* 20(VOUT12) 21(VOUT13) 22(VOUT14) 23(VOUT15) 24(NC)* 25(NC)* 26(NC)* 27(NC)* 30(NC)* 32(MON_IN1)* 33(TEMP_OUT) 48(~{PEC}); IC2 5(TRIM)* 7; IC30 3(NC) 5(TRIM)

### Notes on the sheet
- LOW
- (near IC29) Vtrip= 3.08V
- Project/Equipment
- Document
- Designer
- Drawn by
- Check.by
- Copyright WUT ISE 2020.
  This documentation describes Open Hardware and is licensed under the CERN OHL v.1.2. You may redistribute and modify this documentation under the terms of the CERN OHL v.1.2. (http://ohwr.org/CERNOHL). This documentation is distributed WITHOUT ANY EXPRESS OR IMPLIED WARRANTY, INCLUDING OF MERCHANTABILITY, SATISFACTORY QUALITY AND FITNESS FOR A PARTICULAR PURPOSE. Please see the CERN OHL v.1.2 for applicable conditions.
- Contact
- File
- Last Mod.
- Print Date
- Sheet
- Size
- A3
- of
- Rev
- (in symbol CTE3216-18_10UF_16V_20%_AVX_TCJ) +
- (in symbol R0402_1K_1%_0.0625W_100PPM) 1%
- (in symbol R0603_220R_1%_0.1W_100PPM) 1%

### Library data of the parts
C1 C2 = CC0603_82PF_50V_5%_NP0: Non-polarised capacitor; Part Description: SMD Multilayer Chip Ceramic Capacitor; Manufacturer: GENERIC; Manufacturer1 Part Number: 223886715829; Voltage: 50V; TC: C0G/NP0; Tolerance: ±5%; Part Number: CC0603_82PF_50V_5%_NP0; Component Kind: Standard; Component Type: Standard; Pin Count: 2; Value: 82pF; Status: Preferred; Manufacturer Part Number: CC0603_82PF_50V_5%_NP0; Case: 0603; Mounted: Yes; Socket: No; SMD: Yes; Sense: No; Manufacturer1 Example: PHYCOMP; Manufacturer1 ComponentHeight: 0.87mm; HelpURL: \\cern.ch\dfs\Applications\Altium\Datasheets\CC0603_NP0_PHYCOMP.pdf; Author: CERN DEM JLC; CreateDate: 03.12.2007; LatestRevisionDate: 03.12.2007
C3 C8 C10 C13 C16 C20 = CTE3216-18_10UF_16V_20%_AVX_TCJ: as C90 on sheet LVDS_IFC; Part Number: CTE3216-18_10UF_16V_20%_AVX_TCJ; Component Kind: Standard; Component Type: Standard; Pin Count: 2; Value: 10uF; Status: Preferred; Case: A; Mounted: Yes; Socket: No; SMD: Yes; Sense: No; ComponentHeight: 1.8mm; HelpURL: \\cern.ch\dfs\Applications\Altium\Datasheets\CTE_AVX_TCJ.pdf; Author: CERN DEM JLC; CreateDate: 29.03.2012; LatestRevisionDate: 29.03.2012
C4 C9 C11 C12 C14 C15 C18 C19 C81 C83 C96 C97 = CC0402_100NF_16V_10%_X7R: as C59 on sheet PULSE_TRIGGER; Part Number: CC0402_100NF_16V_10%_X7R; Component Kind: Standard; Component Type: Standard; Pin Count: 2; Value: 100nF; Status: Not Recommended; Manufacturer Part Number: CC0402_100NF_16V_10%_X7R; Case: 0402; Mounted: Yes; Socket: No; SMD: Yes; Sense: No; Manufacturer1 Example: MURATA; Manufacturer1 ComponentHeight: 0.55mm; HelpURL: \\cern.ch\dfs\Applications\Altium\Datasheets\CC0402_X7R_MURATA_GRM.pdf; Author: CERN DEM JLC
  C4 C9 C83 C96 C97: CreateDate: 2013-12-05; LatestRevisionDate: 2007-12-03
  C11 C12 C14 C15 C18 C19: CreateDate: 05.12.2013; LatestRevisionDate: 03.12.2007
  C81: CreateDate: 05/12/2013; LatestRevisionDate: 03/12/2007
C5 C6 = CC0603_2.2UF_16V_10%_X5R: Non-polarised capacitor; Part Description: SMD Multilayer Chip Ceramic Capacitor; Manufacturer: GENERIC; Manufacturer1 Part Number: CC0603KRX5R7BB225; Voltage: 16V; TC: X5R; Tolerance: ±10%; Part Number: CC0603_2.2UF_16V_10%_X5R; Component Kind: Standard; Component Type: Standard; Pin Count: 2; Value: 2.2uF; Status: Preferred; Manufacturer Part Number: CC0603_2.2UF_16V_10%_X5R; Case: 0603; Mounted: Yes; Socket: No; SMD: Yes; Sense: No; Manufacturer1 Example: YAGEO; Manufacturer1 ComponentHeight: 0.9mm; HelpURL: \\cern.ch\dfs\Applications\Altium\Datasheets\CC0805_X5R_PHYCOMP_HC.pdf; Author: CERN DEM JLC; CreateDate: 28.04.2011; LatestRevisionDate: 28.04.2011
C7 = CC0603_1UF_25V_10%_X7R: Non-polarised capacitor; Part Description: SMD Multilayer Chip Ceramic Capacitor; Manufacturer: GENERIC; Manufacturer1 Part Number: GRM188R71E105KA12D; Voltage: 25V; TC: X7R; Tolerance: ±10%; Part Number: CC0603_1UF_25V_10%_X7R; Component Kind: Standard; Component Type: Standard; Pin Count: 2; Value: 1uF; Status: None; Manufacturer Part Number: CC0603_1UF_25V_10%_X7R; Case: 0603; Mounted: Yes; Socket: No; SMD: Yes; Sense: No; Manufacturer1 Example: MURATA; Manufacturer1 ComponentHeight: 0.9mm; HelpURL: \\cern.ch\dfs\Applications\Altium\Datasheets\CC0603_X7R_MURATA.pdf; Author: CERN DEM JLC; CreateDate: 18.01.2011; LatestRevisionDate: 18.01.2011
C17 = CC0805_22UF_16V_10%_X5R: Non-polarised capacitor; Part Description: SMD Multilayer Chip Ceramic Capacitor; Manufacturer: GENERIC; Manufacturer1 Part Number: C2012X5R1C226KT; Voltage: 16V; TC: X5R; Tolerance: ±10%; Part Number: CC0805_22UF_16V_10%_X5R; Component Kind: Standard; Component Type: Standard; Pin Count: 2; Value: 22uF; Status: Preferred; Manufacturer Part Number: CC0805_22UF_16V_10%_X5R; Case: 0805; Mounted: Yes; Socket: No; SMD: Yes; Sense: No; Manufacturer1 Example: TDK; Manufacturer1 ComponentHeight: 1.35mm; HelpURL: \\cern.ch\dfs\Applications\Altium\Datasheets\CC0805_X5R_TDK_C.pdf; Author: CERN DEM JLC; CreateDate: 25.10.2012; LatestRevisionDate: 25.10.2012
C82 = CC0402_10NF_16V_10%_X7R: Non-polarised capacitor; Part Description: SMD Multilayer Chip Ceramic Capacitor; Manufacturer: GENERIC; Manufacturer1 Part Number: 223878715636; Voltage: 16V; TC: X7R; Tolerance: ±10%; Part Number: CC0402_10NF_16V_10%_X7R; Component Kind: Standard; Component Type: Standard; Pin Count: 2; Value: 10nF; Status: Not Recommended; Manufacturer Part Number: CC0402_10NF_16V_10%_X7R; Case: 0402; Mounted: Yes; Socket: No; SMD: Yes; Sense: No; Manufacturer1 Example: PHYCOMP; Manufacturer1 ComponentHeight: 0.55mm; HelpURL: \\cern.ch\dfs\Applications\Altium\Datasheets\CC0402_X7R_PHYCOMP.pdf; Author: CERN DEM JLC; CreateDate: 03.12.2007; LatestRevisionDate: 03.12.2007
IC1 = CMP-0318-00792-2: 14-Bit Digital-to-Analog Converter with Serial Interface, -40 to +85 degC, ST-52, Pb-Free, Tray; Generic Part Number: AD5361; Manufacturer: Analog Devices; Max V+: 16.5V; Resolution (Bits): 14; Single Supply: No; Settling Time: 20Âµs; # DAC Outputs: 16; Op Pwr Diss: 130mW; PackageVersion: 2003; PackageDescription: 52-Lead Low Profile Quad Flat Package [LQFP]; RevisionNote: Component URL fixed; ComponentLink2Description: Datasheet; ComponentLink3URL: http://www.analog.com/static/imported-files/packages/61012411624300842189414155189544791816408612ST_52_10x10.pdf; ComponentLink2URL: http://www.analog.com/static/imported-files/data_sheets/AD5360_5361.pdf; Manufacturer Part Number: AD5361BSTZ; ComponentLink3Description: Package Specification; Mounting Technology: Surface Mount; DatasheetVersion: Rev.A; ComponentLink1Description: Manufacturer URL; ComponentLink4Description: Product URL; RoHS: Y; ComponentLink4URL: http://www.analog.com/en/digital-to-analog-converters/da-converters/ad5361/products/product.html; ComponentLink1URL: http://www.analog.com/en/index.html; Code_JEDEC: MS-026-BCC; Packing: Tray; PackageReference: ST-52
IC2 = MAX6250ACSA+: 1ppm/°C, Low-Noise, Precision, +5.000V Voltage Reference; Manufacturer: MAXIM; PressFit: No; Bonding: No; Part Number: MAX6250ACSA+; Component Kind: Standard; Component Type: Standard; Device: MAX6250ACSA+; PackageDescription: SOIC 8, Pitch 1.27mm, Body 4x5mm, IPC Medium Density; Part Description: 1ppm/°C, Low-Noise, Precision, +5.000V Voltage Reference; Manufacturer Part Number: MAX6250ACSA+; Pin Count: 5; Case: SOIC8; Mounted: Yes; Socket: No; SMD: Yes; Sense: No; ComponentHeight: 1.75mm; HelpURL: \\cern.ch\dfs\Applications\Altium\Datasheets\MAX6250ACSA+.pdf; Author: CERN DEM JMW; CreateDate: 06.07.2015; LatestRevisionDate: 06.07.2015
IC29 = CMP-0138-00412-1: Micropower Voltage Supervisors, 3-Pin SOT-23, Extended Temperature, Tape and Reel; PackageReference: SOT-23-TT3; PackageVersion: revBB, Aug-2009; DatasheetVersion: revB, Mar-2005; Code_IPC: SOT23-3; PackageDescription: 3-Lead Plastic Small Outline Transistor (TT) [SOT-23]
IC30 = ADR431BRZ: 2.5V ±0.12% 10ppm/°C Ultralow Noise XFET Voltage References with Current Sink and Source Capability; Part Description: 2.5V Output,  1mV ±0.04% Accuracy, 3ppm/°C Ultralow Noise XFET Voltage References with Current Sink and Source Capability; Manufacturer: ANALOG DEVICES; PressFit: No; Bonding: No; Part Number: ADR431BRZ; Component Kind: Standard; Component Type: Standard; Device: ADR431BRZ; PackageDescription: SOIC 8, Pitch 1.27mm, Body 4x5mm, IPC Medium Density; Manufacturer Part Number: ADR431BR; Pin Count: 6; Case: SOIC8; Mounted: Yes; Socket: No; SMD: Yes; Sense: No; ComponentHeight: 1.75mm; HelpURL: \\cern.ch\dfs\Applications\Altium\Datasheets\ADR431BRZ.pdf; Author: CERN DEM JLC; CreateDate: 29.10.2013; LatestRevisionDate: 04.04.2022
L1 = IND_10UH_10%_MURATA-PS_8400: Inductor With Core; Part Description: Miniature Surface Mount Power Inductor (8400 Serie); Manufacturer: MURATA POWER SOLUTIONS; Manufacturer Part Number: 84103C; Power: 950mA; Resistance: 0.24R; Tolerance: ±10%; Part Number: IND_10UH_10%_MURATA-PS_8400; Component Kind: Standard; Component Type: Standard; Pin Count: 2; Value: 10uH; Status: None; Mounted: Yes; Socket: No; SMD: Yes; Sense: No; ComponentHeight: 2.9mm; HelpURL: \\cern.ch\dfs\Applications\Altium\Datasheets\IND_MURATA-PS_8400.pdf; Author: CERN DEM JLC; CreateDate: 02.07.2012; LatestRevisionDate: 02.07.2012
R1 R2 = R0603_220R_1%_0.1W_100PPM: Resistor - 1%; Part Description: General Purpose Thick Film Chip Resistor; Manufacturer: GENERIC; Manufacturer1 Part Number: NRC06F2200TRF; Power: 0.1W; TC: ±100ppm/°C; Part Number: R0603_220R_1%_0.1W_100PPM; Component Kind: Standard; Component Type: Standard; Pin Count: 2; Value: 220; Status: Preferred; Tolerance: ±1%; Manufacturer Part Number: R0603_220R_1%_0.1W_100PPM; Case: 0603; Mounted: Yes; Sense: No; Socket: No; SMD: Yes; Manufacturer1 Example: NIC COMPONENT; Manufacturer1 ComponentHeight: 0.55mm; HelpURL: \\cern.ch\dfs\Applications\Altium\Datasheets\R0603_NIC_NRC.pdf; Author: CERN DEM JLC; CreateDate: 03.12.2007; LatestRevisionDate: 13.03.2008
R3 = R0402_0R_JUMPER: Resistor; Part Description: 1A (0.05R Max DC Resistance) Zero Ohm Jumper; Manufacturer: GENERIC; Manufacturer1 Part Number: 232270591001L; Part Number: R0402_0R_JUMPER; Component Kind: Standard; Component Type: Standard; Pin Count: 2; Value: 0; Status: Not recommended; Manufacturer Part Number: R0402_0R_JUMPER; Case: 0402; Mounted: Yes; Sense: No; Socket: No; SMD: Yes; Manufacturer1 Example: YAGEO PHYCOMP; Manufacturer1 ComponentHeight: 0.4mm; HelpURL: \\cern.ch\dfs\Applications\Altium\Datasheets\R0402_Phycomp_RC0402.pdf; Author: CERN DEM JLC; CreateDate: 03.12.2007; LatestRevisionDate: 17.10.2012
R39 = R0402_82R_1%_0.0625W_100PPM: Resistor - 1%; Part Description: General Purpose Thick Film Chip Resistor; Manufacturer: GENERIC; Manufacturer1 Part Number: 232270678209L; TC: ±100ppm/°C; PressFit: No; Part Number: R0402_82R_1%_0.0625W_100PPM; Component Kind: Standard; Component Type: Standard; Pin Count: 2; Value: 82; Status: Not Recommended; Power: 0.0625W; Manufacturer Part Number: R0402_82R_1%_0.0625W_100PPM; Case: 0402; Mounted: Yes; Sense: No; Socket: No; SMD: Yes; Manufacturer1 Example: YAGEO PHYCOMP; Manufacturer1 ComponentHeight: 0.4mm; HelpURL: \\cern.ch\dfs\Applications\Altium\Datasheets\R0402_Phycomp_RC0402.pdf; Author: CERN DEM JLC; CreateDate: 03.12.2007; LatestRevisionDate: 17.10.2012
R83 = R0402_1K_1%_0.0625W_100PPM: Resistor - 1%; Part Description: General Purpose Thick Film Chip Resistor; Manufacturer: GENERIC; Manufacturer1 Part Number: 232270671002L; TC: ±100ppm/°C; PressFit: No; Part Number: R0402_1K_1%_0.0625W_100PPM; Component Kind: Standard; Component Type: Standard; Pin Count: 2; Value: 1k; Status: Not Recommended; Power: 0.0625W; Tolerance: ±1%; Manufacturer Part Number: R0402_1K_1%_0.0625W_100PPM; Case: 0402; Mounted: Yes; Sense: No; Socket: No; SMD: Yes; Manufacturer1 Example: YAGEO PHYCOMP; Manufacturer1 ComponentHeight: 0.4mm; HelpURL: \\cern.ch\dfs\Applications\Altium\Datasheets\R0402_Phycomp_RC0402.pdf; Author: CERN DEM JLC; CreateDate: 03.12.2007; LatestRevisionDate: 17.10.2012; ClassName: Artix
TP1-TP11 = SMD_PAD_1.27X1.27MM: Part Description: 1.27mm x 1.27mm PCB Copper Area (SMD Test Point); Mounted: No; Part Number: SMD_PAD_1.27X1.27MM; Component Type: Standard (No BOM); Pin Count: 1; Family: Test Point; Socket: No; SMD: Yes; Sense: No; Status: None; ComponentHeight: 0mm; HelpURL: Undefined; Author: CERN DEM JLC; CreateDate: 12.01.2008; LatestRevisionDate: 12.01.2008; PackageDescription: 1.27mm x 1.27mm PCB Copper Area (SMD Test Point)